# Altium schematic sheet Battery_Circuit.SchDoc: Battery Circuit
size 279 x 215 mm; Date: 4/2/2024; Author: Isaiah Johnston; Revision: 1; SheetNumber: 1; SheetTotal: 1; ParentProject: Drive-It
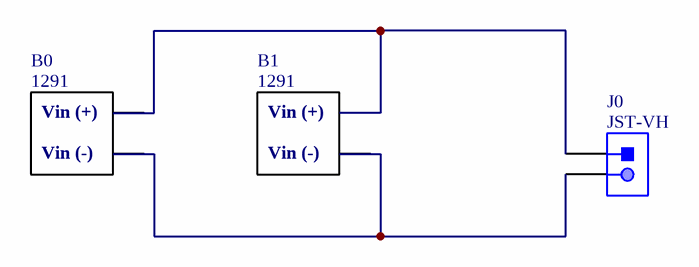
[diagram p0: Battery_Circuit.SchDoc]

## Parts
B0  1291  [1291-Footprint-1]
B1  1291  [1291-Footprint-1]
J0  JST-VH  [JST-B2P-VH(LF)(SN)_V]

## Nets
NetB0_0: B0.0 B1.0 J0.2
NetB0_1: B0.1 B1.1 J0.1

## Notes on the sheet
- SHEET :
- REVISION :
- PARENT :
- SCALE :
- SIZE :
- TITLE :
- DATE :
- 1 : 1
- ANSI  A
- DESIGNED BY :
- (in symbol CMP-00030-00001-7) Vin (+); Vin (-)

## Library data of the parts
B0 B1 = CMP-00030-00001-7: Keystone Electronics Corp. 9 Volt Snap-In Battery Holder
J0 = CMP-002-00025-2: Male Header, Pitch 3.96 mm, 1 x 2 Position, Height 10.9 mm, Tail Length 3.7 mm, -25 to 85 degC, RoHS, Bulk; Manufacturer: JST; Case/Package: B2P-VH(LF)(SN); Connector Type: Header; Mounting Technology: TH; Package Reference: B2P-VH(LF)(SN); Package Description: Male Header, Pitch 3.96 mm, 1 x 2 Position, Height 10.9 mm, Tail Length 3.7 mm; Max Operating Temperature: 85°C; Manufacturer URL: http://www.jst.com/home2.html; RoHS Compliant: Unknown; Datasheet Version: May-16; Gender: Male; Min Operating Temperature: -25°C; Datasheet URL: http://www.jst-mfg.com/product/pdf/eng/eVH.pdf